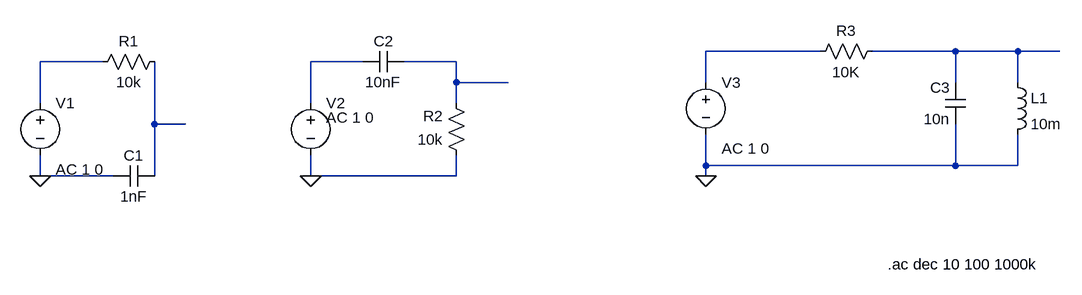
[diagram p0: schematic PreLab 3.asc]
PreLab 3.asc, the LTspice schematic file:
Version 4
SHEET 1 1352 680
WIRE 976 160 800 160
WIRE 1184 160 1056 160
WIRE 1280 160 1184 160
WIRE 1344 160 1280 160
WIRE -128 176 -224 176
WIRE 272 176 192 176
WIRE 416 176 336 176
WIRE 416 208 416 176
WIRE 496 208 416 208
WIRE 800 208 800 160
WIRE 1184 208 1184 160
WIRE 1280 208 1280 160
WIRE -224 240 -224 176
WIRE 192 240 192 176
WIRE 416 240 416 208
WIRE -48 272 -48 176
WIRE 0 272 -48 272
WIRE 800 336 800 288
WIRE 1184 336 1184 272
WIRE 1184 336 800 336
WIRE 1280 336 1280 288
WIRE 1280 336 1184 336
WIRE -224 352 -224 320
WIRE -112 352 -224 352
WIRE -48 352 -48 272
WIRE 192 352 192 320
WIRE 416 352 416 320
WIRE 416 352 192 352
WIRE 800 352 800 336
FLAG -224 352 0
FLAG 192 352 0
FLAG 800 352 0
SYMBOL voltage -224 224 R0
WINDOW 123 24 118 Left 2
SYMATTR InstName V1
SYMATTR Value ""
SYMATTR Value2 AC 1 0
SYMBOL voltage 192 224 R0
WINDOW 123 24 38 Left 2
SYMATTR InstName V2
SYMATTR Value ""
SYMATTR Value2 AC 1 0
SYMBOL res -32 160 R90
WINDOW 0 0 56 VBottom 2
WINDOW 3 32 56 VTop 2
SYMATTR InstName R1
SYMATTR Value 10k
SYMBOL res 432 336 R180
WINDOW 0 36 76 Left 2
WINDOW 3 36 40 Left 2
SYMATTR InstName R2
SYMATTR Value 10k
SYMBOL cap -48 336 R90
WINDOW 0 0 32 VBottom 2
WINDOW 3 32 32 VTop 2
SYMATTR InstName C1
SYMATTR Value 1nF
SYMBOL cap 336 160 R90
WINDOW 0 0 32 VBottom 2
WINDOW 3 32 32 VTop 2
SYMATTR InstName C2
SYMATTR Value 10nF
SYMBOL voltage 800 192 R0
WINDOW 123 24 118 Left 2
SYMATTR InstName V3
SYMATTR Value ""
SYMATTR Value2 AC 1 0
SYMBOL Cap 1200 272 R180
WINDOW 0 24 56 Left 2
WINDOW 3 24 8 Left 2
SYMATTR InstName C3
SYMATTR Value 10n
SYMBOL Res 1072 144 R90
WINDOW 0 0 56 VBottom 2
WINDOW 3 32 56 VTop 2
SYMATTR InstName R3
SYMATTR Value 10K
SYMBOL ind 1264 192 R0
SYMATTR InstName L1
SYMATTR Value 10m
TEXT 1080 488 Left 2 !.ac dec 10 100 1000k

The netlist it stands for:
* PreLab 3.asc
V1 N003 0 AC 1 0
V2 N004 0 AC 1 0
R1 N006 N003 10k
R2 0 N005 10k
C1 N006 0 1nF
C2 N005 N004 10nF
V3 N001 0 AC 1 0
C3 0 N002 10n
R3 N002 N001 10K
L1 N002 0 10m
.ac dec 10 100 1000k
.backanno
.end